# Altium schematic sheet Voltage Sensor Interface.SchDoc
size A
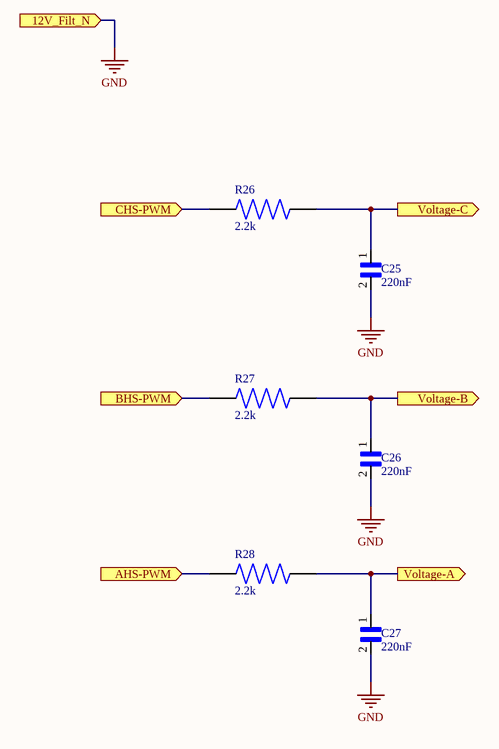
[diagram p0: Voltage Sensor Interface.SchDoc]

## Parts
C25  220nF  [CAP 0805(2012 metric)]
C26  220nF  [CAP 0805(2012 metric)]
C27  220nF  [CAP 0805(2012 metric)]
R26  2.2k  [RES 0805(2012 metric)]
R27  2.2k  [RES 0805(2012 metric)]
R28  2.2k  [RES 0805(2012 metric)]

## Ports
12V_Filt_N (in), AHS-PWM (in), BHS-PWM (in), CHS-PWM (in), Voltage-A (out), Voltage-B (out), Voltage-C (out)

## Nets
GND: C25.2 C26.2 C27.2 ; port 12V_Filt_N
AHS-PWM: R28.1 ; port AHS-PWM
BHS-PWM: R27.1 ; port BHS-PWM
CHS-PWM: R26.1 ; port CHS-PWM
Voltage-A: C27.1 R28.2 ; port Voltage-A
Voltage-B: C26.1 R27.2 ; port Voltage-B
Voltage-C: C25.1 R26.2 ; port Voltage-C

## Library data of the parts
C25-C27 = 220nF 0805: 220nF 0805 50VDC
R26-R28 = 2.2k 0805